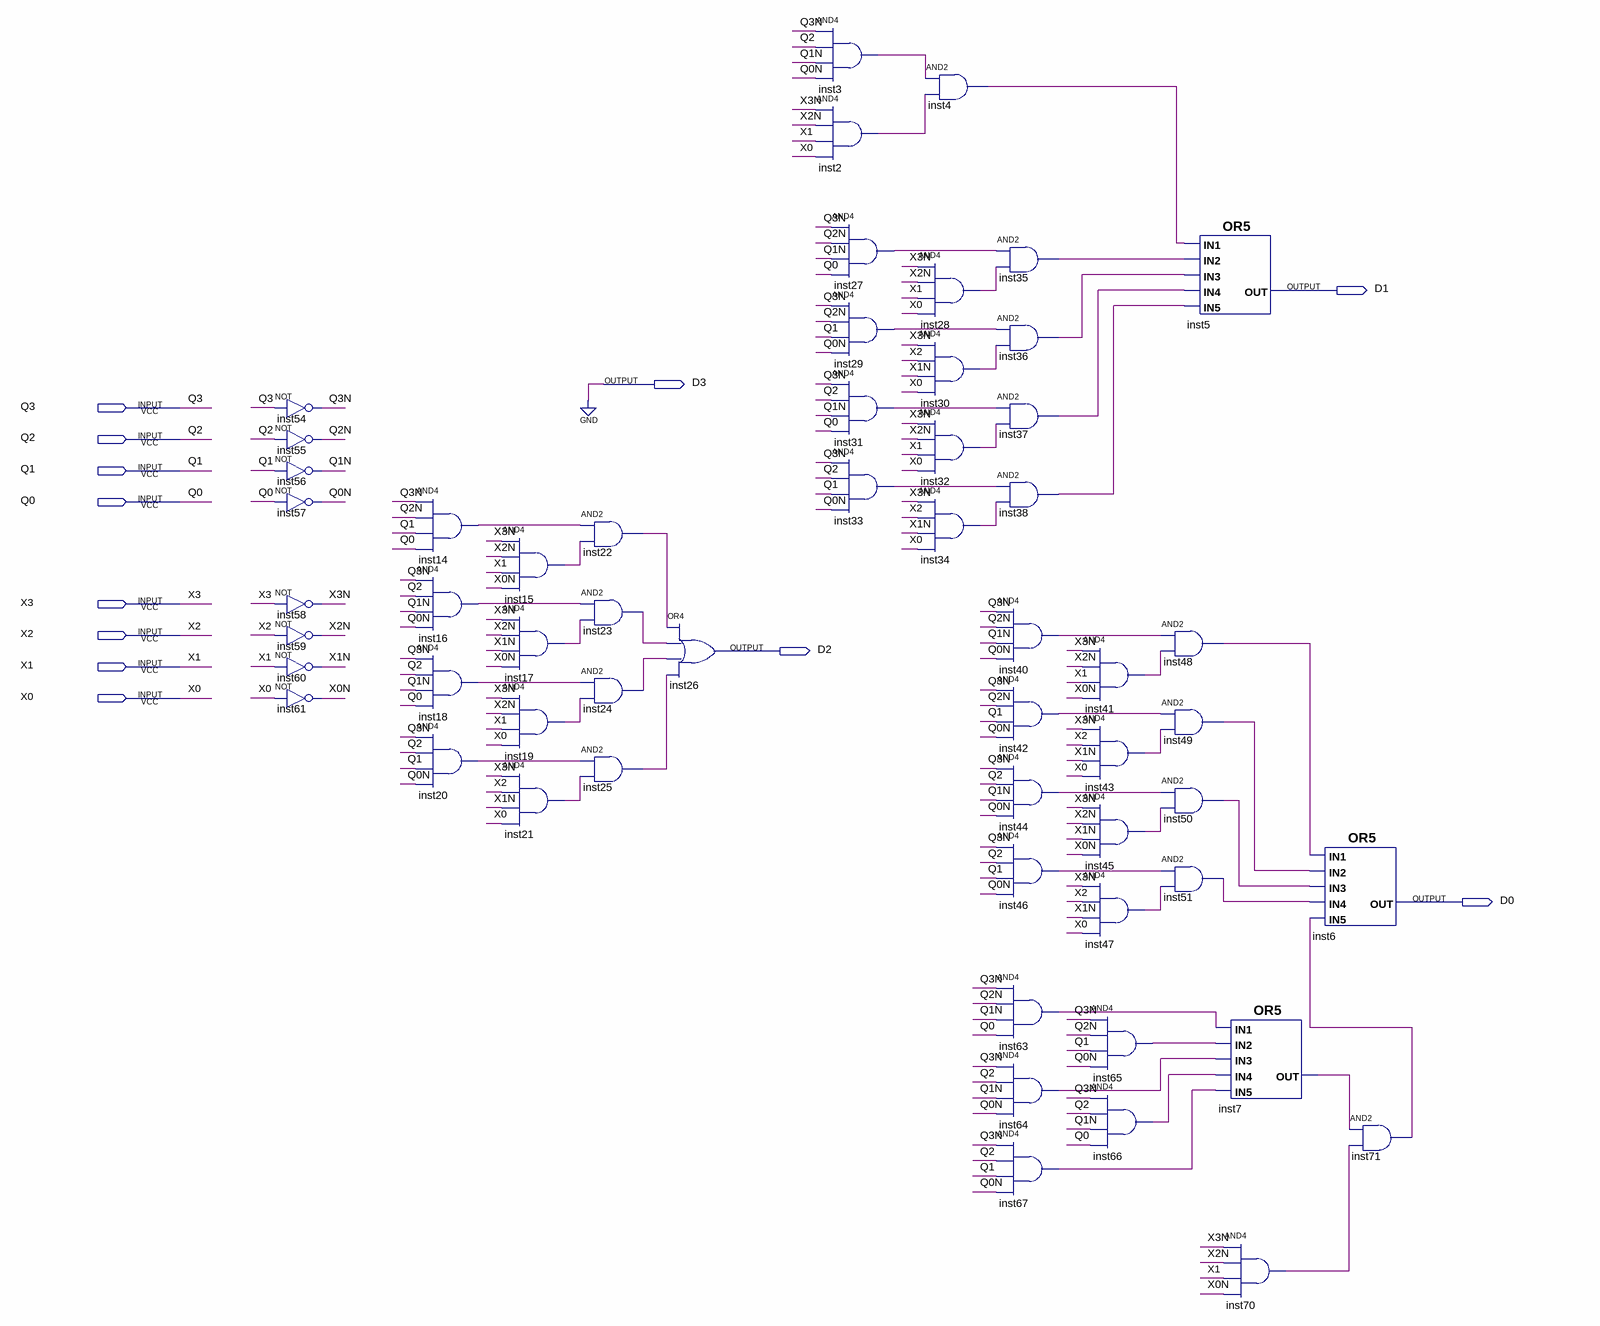
[diagram p0: schematic sheet]
// Quartus schematic CombiMe.bdf as structural Verilog: 58 symbols, 12 pins
module CombiMe (
  input  Q3,
  input  Q2,
  input  Q1,
  input  Q0,
  input  X3,
  input  X2,
  input  X1,
  input  X0,
  output D1,
  output D3,
  output D2,
  output D0
);

  wire inst2_out, inst3_out, inst4_out, inst7_out, inst14_out, inst15_out, inst16_out, inst17_out,
       inst18_out, inst19_out, inst20_out, inst21_out, inst22_out, inst23_out, inst24_out, inst25_out,
       inst27_out, inst28_out, inst29_out, inst30_out, inst31_out, inst32_out, inst33_out, inst34_out,
       inst35_out, inst36_out, inst37_out, inst38_out, inst40_out, inst41_out, inst42_out, inst43_out,
       inst44_out, inst45_out, inst46_out, inst47_out, inst48_out, inst49_out, inst50_out, inst51_out,
       inst63_out, inst64_out, inst65_out, inst66_out, inst67_out, inst70_out, inst71_out, Q0N, Q1N, Q2N,
       Q3N, X0N, X1N, X2N, X3N;

  not inst54 (Q3N, Q3);
  not inst55 (Q2N, Q2);
  not inst56 (Q1N, Q1);
  not inst57 (Q0N, Q0);
  not inst58 (X3N, X3);
  not inst59 (X2N, X2);
  not inst60 (X1N, X1);
  not inst61 (X0N, X0);
  and inst14 (inst14_out, Q3N, Q2N, Q1, Q0);
  and inst16 (inst16_out, Q3N, Q2, Q1N, Q0N);
  and inst18 (inst18_out, Q3N, Q2, Q1N, Q0);
  and inst20 (inst20_out, Q3N, Q2, Q1, Q0N);
  and inst15 (inst15_out, X3N, X2N, X1, X0N);
  and inst17 (inst17_out, X3N, X2N, X1N, X0N);
  and inst19 (inst19_out, X3N, X2N, X1, X0);
  and inst21 (inst21_out, X3N, X2, X1N, X0);
  and inst22 (inst22_out, inst14_out, inst15_out);
  and inst23 (inst23_out, inst16_out, inst17_out);
  and inst24 (inst24_out, inst18_out, inst19_out);
  and inst25 (inst25_out, inst20_out, inst21_out);
  or inst26 (D2, inst22_out, inst23_out, inst24_out, inst25_out);
  and inst3 (inst3_out, Q3N, Q2, Q1N, Q0N);
  and inst2 (inst2_out, X3N, X2N, X1, X0);
  and inst27 (inst27_out, Q3N, Q2N, Q1N, Q0);
  and inst29 (inst29_out, Q3N, Q2N, Q1, Q0N);
  and inst31 (inst31_out, Q3N, Q2, Q1N, Q0);
  and inst33 (inst33_out, Q3N, Q2, Q1, Q0N);
  and inst4 (inst4_out, inst3_out, inst2_out);
  and inst28 (inst28_out, X3N, X2N, X1, X0);
  and inst30 (inst30_out, X3N, X2, X1N, X0);
  and inst32 (inst32_out, X3N, X2N, X1, X0);
  and inst34 (inst34_out, X3N, X2, X1N, X0);
  and inst35 (inst35_out, inst27_out, inst28_out);
  and inst36 (inst36_out, inst29_out, inst30_out);
  and inst37 (inst37_out, inst31_out, inst32_out);
  and inst38 (inst38_out, inst33_out, inst34_out);
  and inst40 (inst40_out, Q3N, Q2N, Q1N, Q0N);
  and inst42 (inst42_out, Q3N, Q2N, Q1, Q0N);
  and inst44 (inst44_out, Q3N, Q2, Q1N, Q0N);
  and inst46 (inst46_out, Q3N, Q2, Q1, Q0N);
  and inst63 (inst63_out, Q3N, Q2N, Q1N, Q0);
  and inst64 (inst64_out, Q3N, Q2, Q1N, Q0N);
  and inst67 (inst67_out, Q3N, Q2, Q1, Q0N);
  and inst41 (inst41_out, X3N, X2N, X1, X0N);
  and inst43 (inst43_out, X3N, X2, X1N, X0);
  and inst45 (inst45_out, X3N, X2N, X1N, X0N);
  and inst47 (inst47_out, X3N, X2, X1N, X0);
  and inst65 (inst65_out, Q3N, Q2N, Q1, Q0N);
  and inst66 (inst66_out, Q3N, Q2, Q1N, Q0);
  or inst5 (D1, inst4_out, inst35_out, inst36_out, inst37_out, inst38_out);
  and inst48 (inst48_out, inst40_out, inst41_out);
  and inst49 (inst49_out, inst42_out, inst43_out);
  and inst50 (inst50_out, inst44_out, inst45_out);
  and inst51 (inst51_out, inst46_out, inst47_out);
  or inst7 (inst7_out, inst63_out, inst65_out, inst64_out, inst66_out, inst67_out);
  and inst70 (inst70_out, X3N, X2N, X1, X0N);
  or inst6 (D0, inst48_out, inst49_out, inst50_out, inst51_out, inst71_out);
  and inst71 (inst71_out, inst7_out, inst70_out);

  assign D3 = 1'b0;
endmodule
